# Altium schematic sheet main.SchDoc
size A3; CompanyName: Head Electronics; Address1: Ambachtsweg 17; Address2: 2222 AH Katwijk; Address3: +31 71 4029 154; Address4: www.head.nl; SheetNumber: 1; SheetTitle: Main
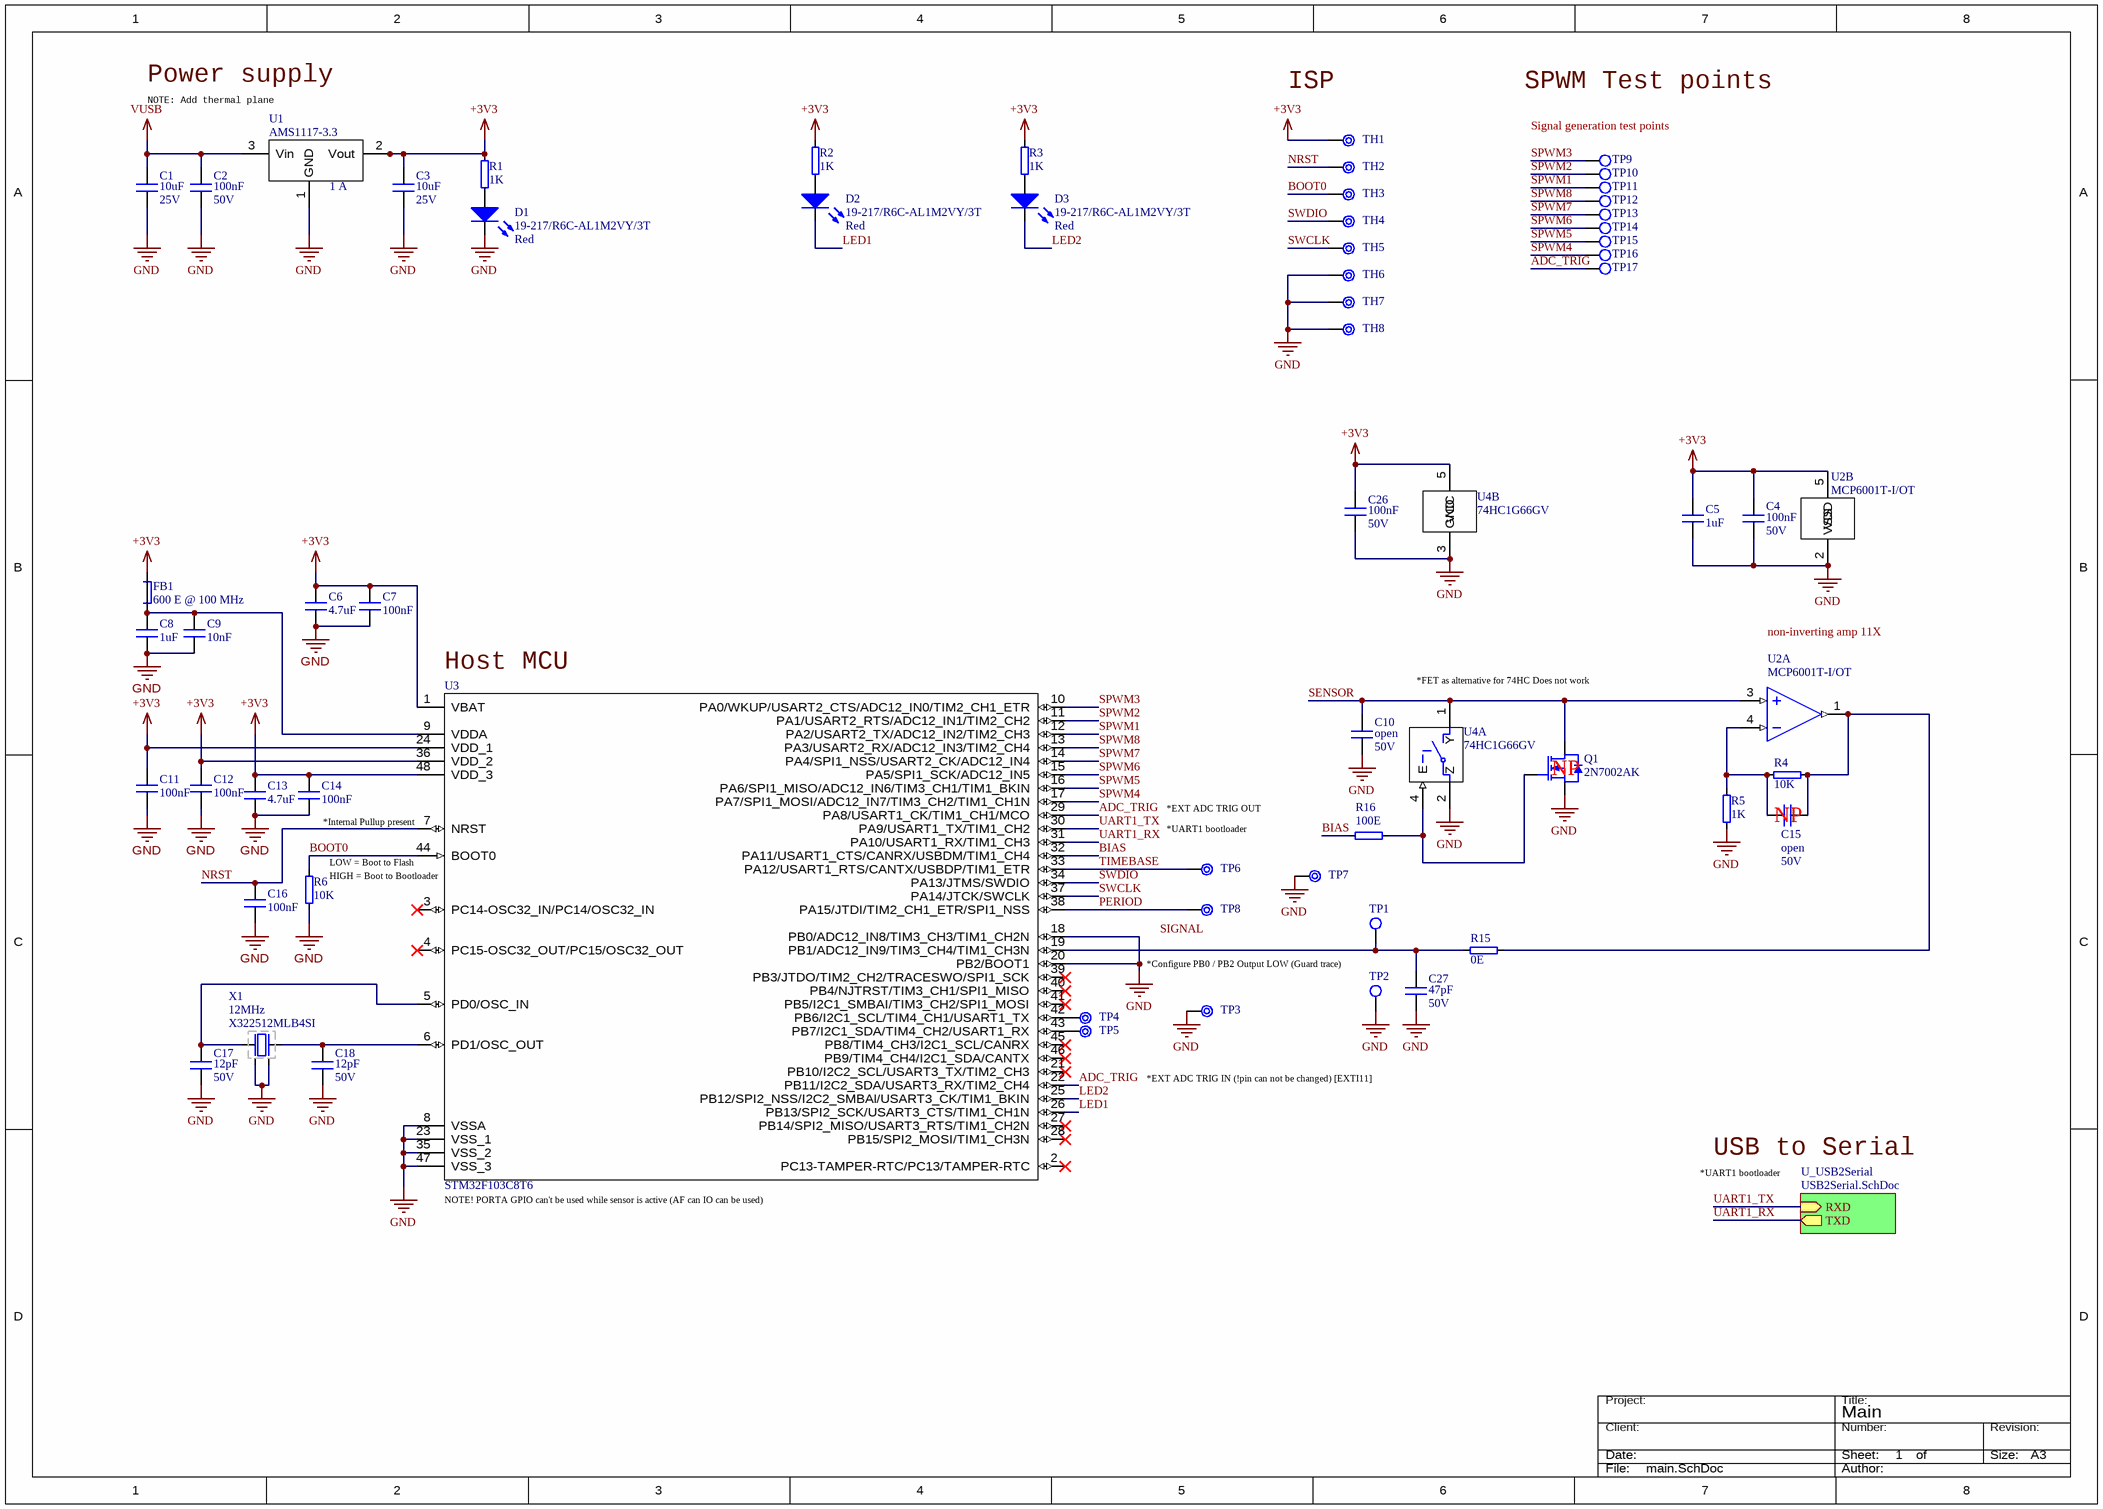
[diagram p0: main.SchDoc]

## Parts
C1  10uF  Voltage: 25V  [CAP 1206 3216 IPC MEDIUM]
C2  100nF  Voltage: 50V  [CAP 0603 1608 IPC MEDIUM]
C3  10uF  Voltage: 25V  [CAP 1206 3216 IPC MEDIUM]
C4  100nF  Voltage: 50V  [CAP 0603 1608 IPC MEDIUM]
C5  1uF  [CAP 0603 1608 IPC MEDIUM]
C6  4.7uF  [CAP 0603 1608 IPC MEDIUM]
C7  100nF  [CAP 0603 1608 IPC MEDIUM]
C8  1uF  [CAP 0603 1608 IPC MEDIUM]
C9  10nF  [CAP 0603 1608 IPC MEDIUM]
C10  open  Voltage: 50V  [CAP 0603 1608 IPC MEDIUM]
C11  100nF  [CAP 0603 1608 IPC MEDIUM]
C12  100nF  [CAP 0603 1608 IPC MEDIUM]
C13  4.7uF  [CAP 0603 1608 IPC MEDIUM]
C14  100nF  [CAP 0603 1608 IPC MEDIUM]
C15  open  Voltage: 50V  [CAP 0603 1608 IPC MEDIUM]
C16  100nF  [CAP 0603 1608 IPC MEDIUM]
C17  12pF  Voltage: 50V  [CAP 0603 1608 IPC MEDIUM]
C18  12pF  Voltage: 50V  [CAP 0603 1608 IPC MEDIUM]
C26  100nF  Voltage: 50V  [CAP 0603 1608 IPC MEDIUM]
C27  47pF  Voltage: 50V  [CAP 0603 1608 IPC MEDIUM]
D1  19-217/R6C-AL1M2VY/3T  Colour: Red  [19-217 - EVERLIGHT]
D2  19-217/R6C-AL1M2VY/3T  Colour: Red  [19-217 - EVERLIGHT]
D3  19-217/R6C-AL1M2VY/3T  Colour: Red  [19-217 - EVERLIGHT]
FB1  600 E @ 100 MHz  [FB 0603 1608 IPC MEDIUM - Murata]
Q1  2N7002AK  [SOT23-3 IPC MEDIUM - NEXPERIA]
R1  1K  [RES 0603 1608 IPC MEDIUM]
R2  1K  [RES 0603 1608 IPC MEDIUM]
R3  1K  [RES 0603 1608 IPC MEDIUM]
R4  10K  [RES 0603 1608 IPC MEDIUM]
R5  1K  [RES 0603 1608 IPC MEDIUM]
R6  10K  [RES 0603 1608 IPC MEDIUM]
R15  0E  [RES 0603 1608 IPC MEDIUM]
R16  100E  [RES 0603 1608 IPC MEDIUM]
TH1  (no value)  [Test Header H1D1.6]  (no BOM)
TH2  (no value)  [Test Header H1D1.6]  (no BOM)
TH3  (no value)  [Test Header H1D1.6]  (no BOM)
TH4  (no value)  [Test Header H1D1.6]  (no BOM)
TH5  (no value)  [Test Header H1D1.6]  (no BOM)
TH6  (no value)  [Test Header H1D1.6]  (no BOM)
TH7  (no value)  [Test Header H1D1.6]  (no BOM)
TH8  (no value)  [Test Header H1D1.6]  (no BOM)
TP1  0.8mm  [TEST POINT 0.8MM]  (value not drawn)  (no BOM)
TP2  0.8mm  [TEST POINT 0.8MM]  (value not drawn)  (no BOM)
TP3  (no value)  [Test Header H1D1.6]  (no BOM)
TP4  (no value)  [Test Header H1D1.6]  (no BOM)
TP5  (no value)  [Test Header H1D1.6]  (no BOM)
TP6  (no value)  [Test Header H1D1.6]  (no BOM)
TP7  (no value)  [Test Header H1D1.6]  (no BOM)
TP8  (no value)  [Test Header H1D1.6]  (no BOM)
TP9  0.5mm  [TEST POINT 0.5MM]  (value not drawn)  (no BOM)
TP10  0.5mm  [TEST POINT 0.5MM]  (value not drawn)  (no BOM)
TP11  0.5mm  [TEST POINT 0.5MM]  (value not drawn)  (no BOM)
TP12  0.5mm  [TEST POINT 0.5MM]  (value not drawn)  (no BOM)
TP13  0.5mm  [TEST POINT 0.5MM]  (value not drawn)  (no BOM)
TP14  0.5mm  [TEST POINT 0.5MM]  (value not drawn)  (no BOM)
TP15  0.5mm  [TEST POINT 0.5MM]  (value not drawn)  (no BOM)
TP16  0.5mm  [TEST POINT 0.5MM]  (value not drawn)  (no BOM)
TP17  0.5mm  [TEST POINT 0.5MM]  (value not drawn)  (no BOM)
U1  AMS1117-3.3  Iout: 1 A  [SOT223 IPC MEDIUM - UMW]
U2  MCP6001T-I/OT  [SOT23-5 IPC MEDIUM - MICROCHIP]  (parts A,B of 2)
U3  STM32F103C8T6  [LQFP48 IPC MEDIUM - STMICROELECTRONICS]
U4  74HC1G66GV  [SOT753 IPC MEDIUM - NEXPERIA]  (parts A,B of 2)
X1  X322512MLB4SI  Frequency: 12MHz  [X322512MLB4SI - YXC]

## Sub-sheets
U_USB2Serial = USB2Serial.SchDoc: TXD (out), RXD (in)

## Nets
+3V3: C3.1 C4.1 C5.1 C6.1 C7.1 C11.1 C12.1 C13.1 C14.1 C26.1 FB1.1 R1.2 R2.2 R3.2 TH1.1 U1.2(Vout) U1.4(Vout) U2.5(VDD) U3.1(VBAT) U3.24(VDD_1) U3.36(VDD_2) U3.48(VDD_3) U4.5(VCC)
GND: C1.2 C2.2 C3.2 C4.2 C5.2 C6.2 C7.2 C8.2 C9.2 C10.2 C11.2 C12.2 C13.2 C14.2 C16.2 C17.2 C18.2 C26.2 C27.2 D1.2(C) Q1.2(S) R5.1 R6.2 TH6.1 TH7.1 TH8.1 TP2.1 TP3.1 TP7.1 U1.1(GND) U2.2(VSS) U3.8(VSSA) U3.18(PB0/ADC12_IN8/TIM3_CH3/TIM1_CH2N) U3.20(PB2/BOOT1) U3.23(VSS_1) U3.35(VSS_2) U3.47(VSS_3) U4.2(Z) U4.3(GND) X1.2(GND) X1.4(GND)
VUSB: C1.1 C2.1 U1.3(Vin)
ADC_TRIG: TP17.1 U3.22(PB11/I2C2_SDA/USART3_RX/TIM2_CH4) U3.29(PA8/USART1_CK/TIM1_CH1/MCO)
BIAS: R16.1 U3.32(PA11/USART1_CTS/CANRX/USBDM/TIM1_CH4)
BOOT0: R6.1 TH3.1 U3.44(BOOT0)
LED1: D2.2(C) U3.26(PB13/SPI2_SCK/USART3_CTS/TIM1_CH1N)
LED2: D3.2(C) U3.25(PB12/SPI2_NSS/I2C2_SMBAl/USART3_CK/TIM1_BKIN)
NRST: C16.1 TH2.1 U3.7(NRST)
PERIOD: TP8.1 U3.38(PA15/JTDI/TIM2_CH1_ETR/SPI1_NSS)
SENSOR: C10.1 Q1.3(D) U2.3(VIN+) U4.1(Y)
SPWM1: TP11.1 U3.12(PA2/USART2_TX/ADC12_IN2/TIM2_CH3)
SPWM2: TP10.1 U3.11(PA1/USART2_RTS/ADC12_IN1/TIM2_CH2)
SPWM3: TP9.1 U3.10(PA0/WKUP/USART2_CTS/ADC12_IN0/TIM2_CH1_ETR)
SPWM4: TP16.1 U3.17(PA7/SPI1_MOSI/ADC12_IN7/TIM3_CH2/TIM1_CH1N)
SPWM5: TP15.1 U3.16(PA6/SPI1_MISO/ADC12_IN6/TIM3_CH1/TIM1_BKIN)
SPWM6: TP14.1 U3.15(PA5/SPI1_SCK/ADC12_IN5)
SPWM7: TP13.1 U3.14(PA4/SPI1_NSS/USART2_CK/ADC12_IN4)
SPWM8: TP12.1 U3.13(PA3/USART2_RX/ADC12_IN3/TIM2_CH4)
SWCLK: TH5.1 U3.37(PA14/JTCK/SWCLK)
SWDIO: TH4.1 U3.34(PA13/JTMS/SWDIO)
TIMEBASE: TP6.1 U3.33(PA12/USART1_RTS/CANTX/USBDP/TIM1_ETR)
UART1_RX: U3.31(PA10/USART1_RX/TIM1_CH3) ; sheet U_USB2Serial/TXD
UART1_TX: U3.30(PA9/USART1_TX/TIM1_CH2) ; sheet U_USB2Serial/RXD
NetC8_1: C8.1 C9.1 FB1.2 U3.9(VDDA)
NetC15_1: C15.1 R4.1 R5.2 U2.4(VIN-)
NetC15_2: C15.2 R4.2 R15.2 U2.1(VOUT)
NetC17_1: C17.1 U3.5(PD0/OSC_IN) X1.1(in)
NetC18_1: C18.1 U3.6(PD1/OSC_OUT) X1.3(out)
NetC27_1: C27.1 R15.1 TP1.1 U3.19(PB1/ADC12_IN9/TIM3_CH4/TIM1_CH3N)
NetD1_1: D1.1(A) R1.1
NetD2_1: D2.1(A) R2.1
NetD3_1: D3.1(A) R3.1
NetQ1_1: Q1.1(G) R16.2 U4.4(E)
NetTP4_1: TP4.1 U3.42(PB6/I2C1_SCL/TIM4_CH1/USART1_TX)
NetTP5_1: TP5.1 U3.43(PB7/I2C1_SDA/TIM4_CH2/USART1_RX)

Not connected (* = marked no-connect by the designer): U3 2(PC13-TAMPER-RTC/PC13/TAMPER-RTC)* 3(PC14-OSC32_IN/PC14/OSC32_IN)* 4(PC15-OSC32_OUT/PC15/OSC32_OUT)* 21(PB10/I2C2_SCL/USART3_TX/TIM2_CH3)* 27(PB14/SPI2_MISO/USART3_RTS/TIM1_CH2N)* 28(PB15/SPI2_MOSI/TIM1_CH3N)* 39(PB3/JTDO/TIM2_CH2/TRACESWO/SPI1_SCK)* 40(PB4/NJTRST/TIM3_CH1/SPI1_MISO)* 41(PB5/I2C1_SMBAI/TIM3_CH2/SPI1_MOSI)* 45(PB8/TIM4_CH3/I2C1_SCL/CANRX)* 46(PB9/TIM4_CH4/I2C1_SDA/CANTX)*

## Notes on the sheet
- NOTE: Add thermal plane
- Power supply
- ISP
- SPWM Test points
- Signal generation test points
- non-inverting amp 11X
- (near U3) Host MCU
- *FET as alternative for 74HC Does not work
- (near Q1) NP
- (near U3) *Internal Pullup present
- (near TP6) *UART1 bootloader
- *EXT ADC TRIG OUT
- (near C15) NP
- LOW = Boot to Flash
- (near U3) HIGH = Boot to Bootloader
- *Configure PB0 / PB2 Output LOW (Guard trace)
- *EXT ADC TRIG IN (!pin can not be changed) [EXTI11]
- *UART1 bootloader
- USB to Serial
- (near U3) NOTE! PORTA GPIO can't be used while sensor is active (AF can IO can be used)
- Labels drawn without touching a wire or pin: SIGNAL
- Date:
- Client:
- Project:
- Sheet:
- Number:
- Title:
- of
- Size:
- Revision:
- A3
- File:
- Author:

## Library data of the parts
C1 C3 = 86: 10uF ±10% 25V X5R 1206 Multilayer Ceramic Capacitors MLCC - SMD/SMT RoHS; Part Number: CL31A106KAHNNNE; Manufacturer: SAMSUNG; DB_ID: 86; Max Temperature: 85°C; Case Technology: SMT; Capacitance: 10uF; Dielectric: X5R; Tolerance: 10%; Supplier 1: LCSC; Supplier Part Number 1: C9807; Supplier 2: Farnell; ComponentLink1Description: Octopart Search; ComponentLink1URL: https://octopart.com/search?q=CL31A106KAHNNNE&currency=USD&specs=0; Supplier 3: Mouser; Supplier Part Number 2: 3013511; Supplier Part Number 3: 187-CL31A106KAHNNNE
C2 C4 C7 C11 C12 C14 C16 C26 = 62: 100nF ±10% 50V X7R 0603 Multilayer Ceramic Capacitors MLCC - SMD/SMT RoHS; Part Number: C0603B104K500NT; Manufacturer: TORCH; DB_ID: 62; Tolerance: 20%; Max Temperature: 125°C; Case Technology: SMT; Capacitance: 100nF; Dielectric: X7R; Supplier 1: LCSC; Supplier Part Number 1: C478888; ComponentLink1Description: Octopart Search; ComponentLink1URL: http://octopart.com/search?q=C0603C104M4RACTU%20KEMET
  C7 C11 C12 C14 C16: Voltage: 50V
C5 C8 = 74: Generic 0603 1608 Capacitor; Part Number: CGA3E1X7R1C105M080AC; Manufacturer: TDK; DB_ID: 74; Dielectric: X7R; Voltage: 16V; Tolerance: 20%; Max Temperature: 125°C; Case Technology: SMT; Capacitance: 1uF; Supplier 1: Farnell; Supplier Part Number 1: 2768390; ComponentLink1Description: Octopart Search; ComponentLink1URL: http://octopart.com/search?q=CGA3E1X7R1C105M080AC%20TDK
C6 C13 = 82: 4.7 µF, 25 V, 0603 [1608 Metric], ± 10%, X5R, GRM Series; Part Number: GRM188R61E475KE11D; Manufacturer: MURATA; DB_ID: 82; Voltage: 25V; Max Temperature: 85°C; Case Technology: SMT; Capacitance: 4.7uF; Dielectric: X5R; Tolerance: 10%; Supplier 1: Farnell; Supplier Part Number 1: 2426959; ComponentLink1Description: Octopart Search; ComponentLink1URL: http://octopart.com/search?q=GRM188R61E475KE11D%20MURATA
C9 = 50: Generic 0603 1608 Capacitor; Part Number: x; DB_ID: 50; Dielectric: C0G/NP0; Voltage: 50V; Tolerance: 10%; Max Temperature: 125°C; Case Technology: SMT; Capacitance: 10nF; Supplier 1: Farnell; Supplier Part Number 1: 2495178
C10 C15 = 1: Capacitor 0603 1608 value undefined; Part Number: x; DB_ID: 1; Dielectric: C0G/NP0; Tolerance: 10%; Max Temperature: 125°C; Case Technology: SMT; Capacitance: open
C17 C18 = 15: 12pF ±5% 50V NP0 0603 Multilayer Ceramic Capacitors MLCC - SMD/SMT RoHS; Part Number: CC0603JRNPO9BN120; Manufacturer: YAGEO; DB_ID: 15; Dielectric: C0G/NP0; Max Temperature: 125°C; Case Technology: SMT; Capacitance: 12pF; Tolerance: 5%; Supplier 1: LCSC; Supplier 2: Farnell; ComponentLink1Description: Octopart Search; ComponentLink1URL: https://octopart.com/cc0603jrnpo9bn120-yageo-9289271?r=sp; Supplier 3: Mouser; Supplier Part Number 1: C107034; Supplier Part Number 2: 721979; Supplier Part Number 3: 603-CC603JRNPO9BN120
C27 = 22: Generic 0603 1608 Capacitor; Part Number: x; DB_ID: 22; Dielectric: C0G/NP0; Tolerance: 10%; Max Temperature: 125°C; Case Technology: SMT; Capacitance: 47pF
D1-D3 = 11: Red 617.5~633.5nm 0603 Light Emitting Diodes (LED) RoHS; Manufacturer: EVERLIGHT; DB_ID: 11; Case Technology: SMT; Vf: 2.2 V; If: 5 mA; Wavelenght: 632 nm; Part Number: 19-217/R6C-AL1M2VY/3T; Supplier 1: LCSC; Supplier Part Number 1: C72044; ComponentLink1Description: Octopart Search; ComponentLink1URL: http://octopart.com/search?q=19-217/R6C-AL1M2VY/3T%20EVERLIGHT; ComponentLink2Description: Datasheet; ComponentLink2URL: C:\Users\Admin\stack\Altium\Database_2.0\Datasheets\19-217 R6C-AL1M2VY 3T - Datasheet - EVERLIGHT.pdf; ComponentLink3Description: Product page; ComponentLink3URL: https://www.everlight.com/SeriationProduct.aspx?Seq=ab6bdd5e-2405-e411-8b3b-0002a54e500f
FB1 = 1: Ferrite Bead, 0603 [1608 Metric], 600 ohm, 500 mA, BLM18A Series, 0.38 ohm, ± 25%; Part Number: BLM18AG601SN1D; Manufacturer: MURATA; DB_ID: 1; Case Technology: SMT; Current rating: 500 mA; DC Resistance: 0.38 E; ComponentLink2Filename: BLM18KG121TN1D - Datasheet - MURATA; Impedance @ Frequency: 600 E @ 100 MHz; Supplier 1: Farnell; Supplier Part Number 1: 1515679; Supplier 2: Mouser; Supplier Part Number 2: 81-BLM11A601S; Supplier 3: LCSC; Supplier Part Number 3: C19330; ComponentLink1Description: Octopart Search; ComponentLink1URL: http://octopart.com/search?q=BLM18AG601SN1D%20MURATA; ComponentLink2Description: Datasheet; ComponentLink2URL: C:\Users\Admin\stack\Altium\Database_2.0\Datasheets\BLM18KG121TN1D - Datasheet - MURATA.pdf
Q1 = 7: Power MOSFET, N Channel, 60 V, 190 mA, 3 ohm, SOT-23 TO-236AB; Manufacturer: NEXPERIA; DB_ID: 7; Case Technology: SMT; FET Type: N-Channel; Id: 190 mA; Vds: 60 V; Rds(on): 3 E; Vgs(th): 2.1 V; Pd: 265 mW; Part Number: 2N7002AK; Subcategory: Single; Supplier 1: Farnell; Supplier Part Number 1: 2191746; Supplier 2: Mouser; Supplier Part Number 2: 771-NX7002AK,215; Supplier 3: LCSC; Supplier Part Number 3: C255584; ComponentLink1Description: Octopart Search; ComponentLink1URL: https://octopart.com/nx7002ak%2C215-nexperia-78740588?r=sp#PriceAndStock; ComponentLink2Description: Datasheet; ComponentLink2URL: C:\Users\Admin\stack\Altium\Database_2.0\Datasheets\NX7002AK - Datasheet - NEXPERIA.pdf; ComponentLink3Description: Product page; ComponentLink3URL: https://www.nexperia.com/products/mosfets/small-signal-mosfets/NX7002AK.html
R1-R3 R5 = 75: 1kΩ ±1% 0.1W ±100ppm/℃ 0603 Chip Resistor - Surface Mount RoHS; Part Number: RC0603FR-071KL; Manufacturer: YAGEO; DB_ID: 75; Case Technology: SMT; Voltage: 75V; Power: 100mW; Subcategory: Resistor E24 Range; Resistance: 1K; Tolerance: 1%; Supplier 1: LCSC; Supplier Part Number 1: C22548; Supplier 2: Farnell; ComponentLink1Description: Octopart Search; ComponentLink1URL: https://octopart.com/rc0603fr-071kl-yageo-55402882?r=sp; Supplier 3: Mouser; Supplier Part Number 2: 2421849; Supplier Part Number 3: 603-RC0603FR-071KL
R4 = 99: 10kΩ ±1% 0.1W ±100ppm/℃ 0603 Chip Resistor - Surface Mount RoHS; Part Number: RC0603FR-0710KL; Manufacturer: YAGEO; DB_ID: 99; Case Technology: SMT; Voltage: 75V; Power: 100mW; Subcategory: Resistor E24 Range; Resistance: 10K; Tolerance: 1%; Supplier 1: LCSC; Supplier Part Number 1: C98220; Supplier 2: Farnell; Supplier Part Number 2: 2421850; Supplier 3: Digikey; Supplier Part Number 3: 311-10.0KHRCT-ND; ComponentLink1Description: Octopart Search; ComponentLink1URL: https://octopart.com/rc0603fr-0710kl-yageo-40025538?r=sp
R6 = 99: 10kΩ ±1% 0.1W ±100ppm/℃ 0603 Chip Resistor - Surface Mount RoHS; Part Number: RC0603FR-0710KL; Manufacturer: YAGEO; DB_ID: 99; Voltage: 75V; Power: 100mW; Case Technology: SMT; Resistance: 10K; Tolerance: 1%; Supplier 1: LCSC; Supplier Part Number 1: C98220; Subcategory: Resistor E24 Range; Supplier 2: Farnell; Supplier Part Number 2: 2421850; Supplier 3: Digikey; Supplier Part Number 3: 311-10.0KHRCT-ND; ComponentLink1Description: Octopart Search; ComponentLink1URL: https://octopart.com/rc0603fr-0710kl-yageo-40025538?r=sp
R15 = 2: 0Ω ±1.0% 1/10W Thick Film Resistors 75V -55℃~+155℃ 0603 Chip Resistor - Surface Mount RoHS; Part Number: RC0603FR-070RL; Manufacturer: YAGEO; DB_ID: 2; Case Technology: SMT; Power: 100mW; Tolerance: 1%; Subcategory: Resistor E24 Range; Resistance: 0E; Voltage: 75V; Supplier 1: LCSC; Supplier Part Number 1: C100044; Supplier 2: Farnell; Supplier Part Number 2: 2309106; Supplier 3: Mouser; Supplier Part Number 3: 603-RC0603FR-070RL; ComponentLink1Description: Octopart Search; ComponentLink1URL: https://octopart.com/rc0603fr-070rl-yageo-1180803?r=sp#PriceAndStock
R16 = 51: 100Ω ±1.0% 1/10W ±100ppm/℃ Thick Film Resistors 75V -55℃~+155℃ 0603 Chip Resistor - Surface Mount RoHS; Part Number: RC0603FR-07100RL; Manufacturer: YAGEO; DB_ID: 51; Case Technology: SMT; Power: 100mW; Tolerance: 1%; Subcategory: Resistor E24 Range; Resistance: 100E; Voltage: 75V; Supplier 1: LCSC; Supplier Part Number 1: C105588; Supplier 2: Farnell; Supplier Part Number 2: 2421848; Supplier 3: Mouser; Supplier Part Number 3: 603-RC0603FR-07100RL; ComponentLink1Description: Octopart Search; ComponentLink1URL: https://octopart.com/rc0603fr-07100rl-yageo-55402879?r=sp#PriceAndStock
TH1-TH8 TP3-TP8 = 4: Octagonal THT H1D1.6mm test header; DB_ID: 4; Case Technology: THT; Size: 1.6mm
TP1 TP2 = 5: Round 0.8mm testpoint; DB_ID: 5; Case Technology: SMT; Size: 0.8mm
TP9-TP17 = 2: Round 0.5mm testpoint; DB_ID: 2; Case Technology: SMT; Size: 0.5mm
U1 = 24: LDO 3.3V 1A 18V; Manufacturer: UMW; DB_ID: 24; Case Technology: SMT; Vin Min: 0 V; V dropout: 1.3 V @ 1 A; Part Number: AMS1117-3.3; Subcategory: LDO Voltage Regulators; Vin Max: 18 V; Vout: 3.3 V; Supplier 1: LCSC; Supplier Part Number 1: C347222; ComponentLink1Description: Octopart Search; ComponentLink1URL: https://octopart.com/ams1117-3.3-umw%28youtai+semiconductor+co.%2C+ltd.%29-121753726?r=sp; ComponentLink2Description: Datasheet; ComponentLink2URL: C:\Users\Admin\stack\Altium\Database_2.0\Datasheets\AMS1117-3.3 - Datasheet - UMW.pdf; ComponentLink3Description: Product page; ComponentLink3URL: http://www.umw-ic.com/en/product_details/UMW+AMS1117-3.3
U2 = 21: Operational Amplifier, Single, 1 Amplifier, 1 MHz, 0.6 V/µs, 1.8V to 6V, SOT-23, 5 Pins; Manufacturer: MICROCHIP; DB_ID: 21; Case Technology: SMT; Part Number: MCP6001T-I/OT; Subcategory: Op Amps; Vin min: 1.8 V; Vin typ: -; Vin max: 6 V; Supplier 1: Farnell; Supplier Part Number 1: 4974992; Supplier 2: LCSC; Supplier 3: -; ComponentLink1Description: Octopart Search; ComponentLink1URL: http://octopart.com/search?q=MCP6001T-I/OT%20MICROCHIP; ComponentLink2Description: Datasheet; ComponentLink2URL: C:\Users\Admin\stack\Altium\Database_2.0\Datasheets\MCP6001T-I OT - Datasheet - MICROCHIP.pdf; ComponentLink3Description: Product page; ComponentLink3URL: https://www.microchip.com/wwwproducts/en/MCP6001; Supplier Part Number 2: C116490
U3 = 20: ARM Microcontroller, Motor Control, STM32 Family STM32F1 Series Microcontrollers, ARM Cortex-M3; Manufacturer: STMICROELECTRONICS; DB_ID: 20; Case Technology: SMT; Vin min: 2 V; Vin max: 3.6 V; Part Number: STM32F103C8T6; Subcategory: Microcontrollers; Vin typ: -; Supplier 1: Farnell; Supplier Part Number 1: 1447637; Supplier 2: Mouser; Supplier Part Number 2: 511-STM32F103C8T6; Supplier 3: LCSC; Supplier Part Number 3: C8734; ComponentLink1Description: Octopart Search; ComponentLink1URL: http://octopart.com/search?q=STM32F103C8T6%20STMICROELECTRONICS; ComponentLink2Description: Datasheet; ComponentLink2URL: C:\Users\Admin\stack\Altium\Database_2.0\Datasheets\STM32F103C8T6 - Datasheet - STMICROELECTRONICS.pdf; ComponentLink3Description: Product page; ComponentLink3URL: http://www.st.com/en/microcontrollers/stm32f103c8.html
U4 = 77: Analogue Switch, SPST, 1 Channels, 50 ohm, 2V to 9V, TSOP, 5 Pins; Manufacturer: NEXPERIA; DB_ID: 77; Case Technology: SMT; Vin min: 2.0 V; Vin max: 9.0 V; Part Number: 74HC1G66GV; Subcategory: Analogue Switches; Vin typ: -; Supplier 1: LCSC; Supplier Part Number 1: C89412; Supplier 2: Farnell; Supplier 3: Mouser; ComponentLink1Description: Octopart Search; ComponentLink1URL: https://octopart.com/74hc1g66gv%2C125-nexperia-78737123?r=sp; ComponentLink2Description: Datasheet; ComponentLink2URL: C:\Users\Admin\stack\Altium\Database_2.0\Datasheets\74HC1G66GV - Datasheet - NEXPERIA.pdf; ComponentLink3Description: Product Page; ComponentLink3URL: https://www.nexperia.com/products/analog-logic-ics/i-o-expansion-logic/analog-switches/74AHC1G66GV.html; Supplier Part Number 2: 2777726; Supplier Part Number 3: 771-HC1G66GV125
X1 = 6: 12MHz ±10ppm 9pF 80Ω SMD-3225_4P Crystals RoHS; Manufacturer: YXC; DB_ID: 6; Case Technology: SMT; Min Temperature: -40°C; Max Temperature: 85°C; Part Number: X322512MLB4SI; Frequency Tolerance: 10ppm; Load Capacitance: 9pF; Supplier 1: LCSC; Supplier Part Number 1: C112971; ComponentLink1Description: Octopart Search; ComponentLink1URL: https://octopart.com/x322512mlb4si-yxc-99368244?r=sp; ComponentLink2Description: Datasheet; ComponentLink2URL: C:\Users\Admin\stack\Altium\Database_2.0\Datasheets\X322512MLB4SI - Datasheet - YXC.pdf; ComponentLink3Description: Product page; ComponentLink3URL: http://www.yxc.hk/3225smdjingzhen/YSX321SL.html